# Altium schematic sheet DE-010824.SchDoc: eDoor_Motherboard
size A3; Author: eldar6776@hotmail.com; DrawnBy: Eldar Dedic; Organization: JUBERA d.o.o.; Address1: Braće Mulić 81; Address2: 71000 Sarajevo; Address3: Federacija BiH; Address4: Bosna i Hercegovina; DocumentNumber: DE-010824; Revision: 001; SheetNumber: 1; SheetTotal: 2
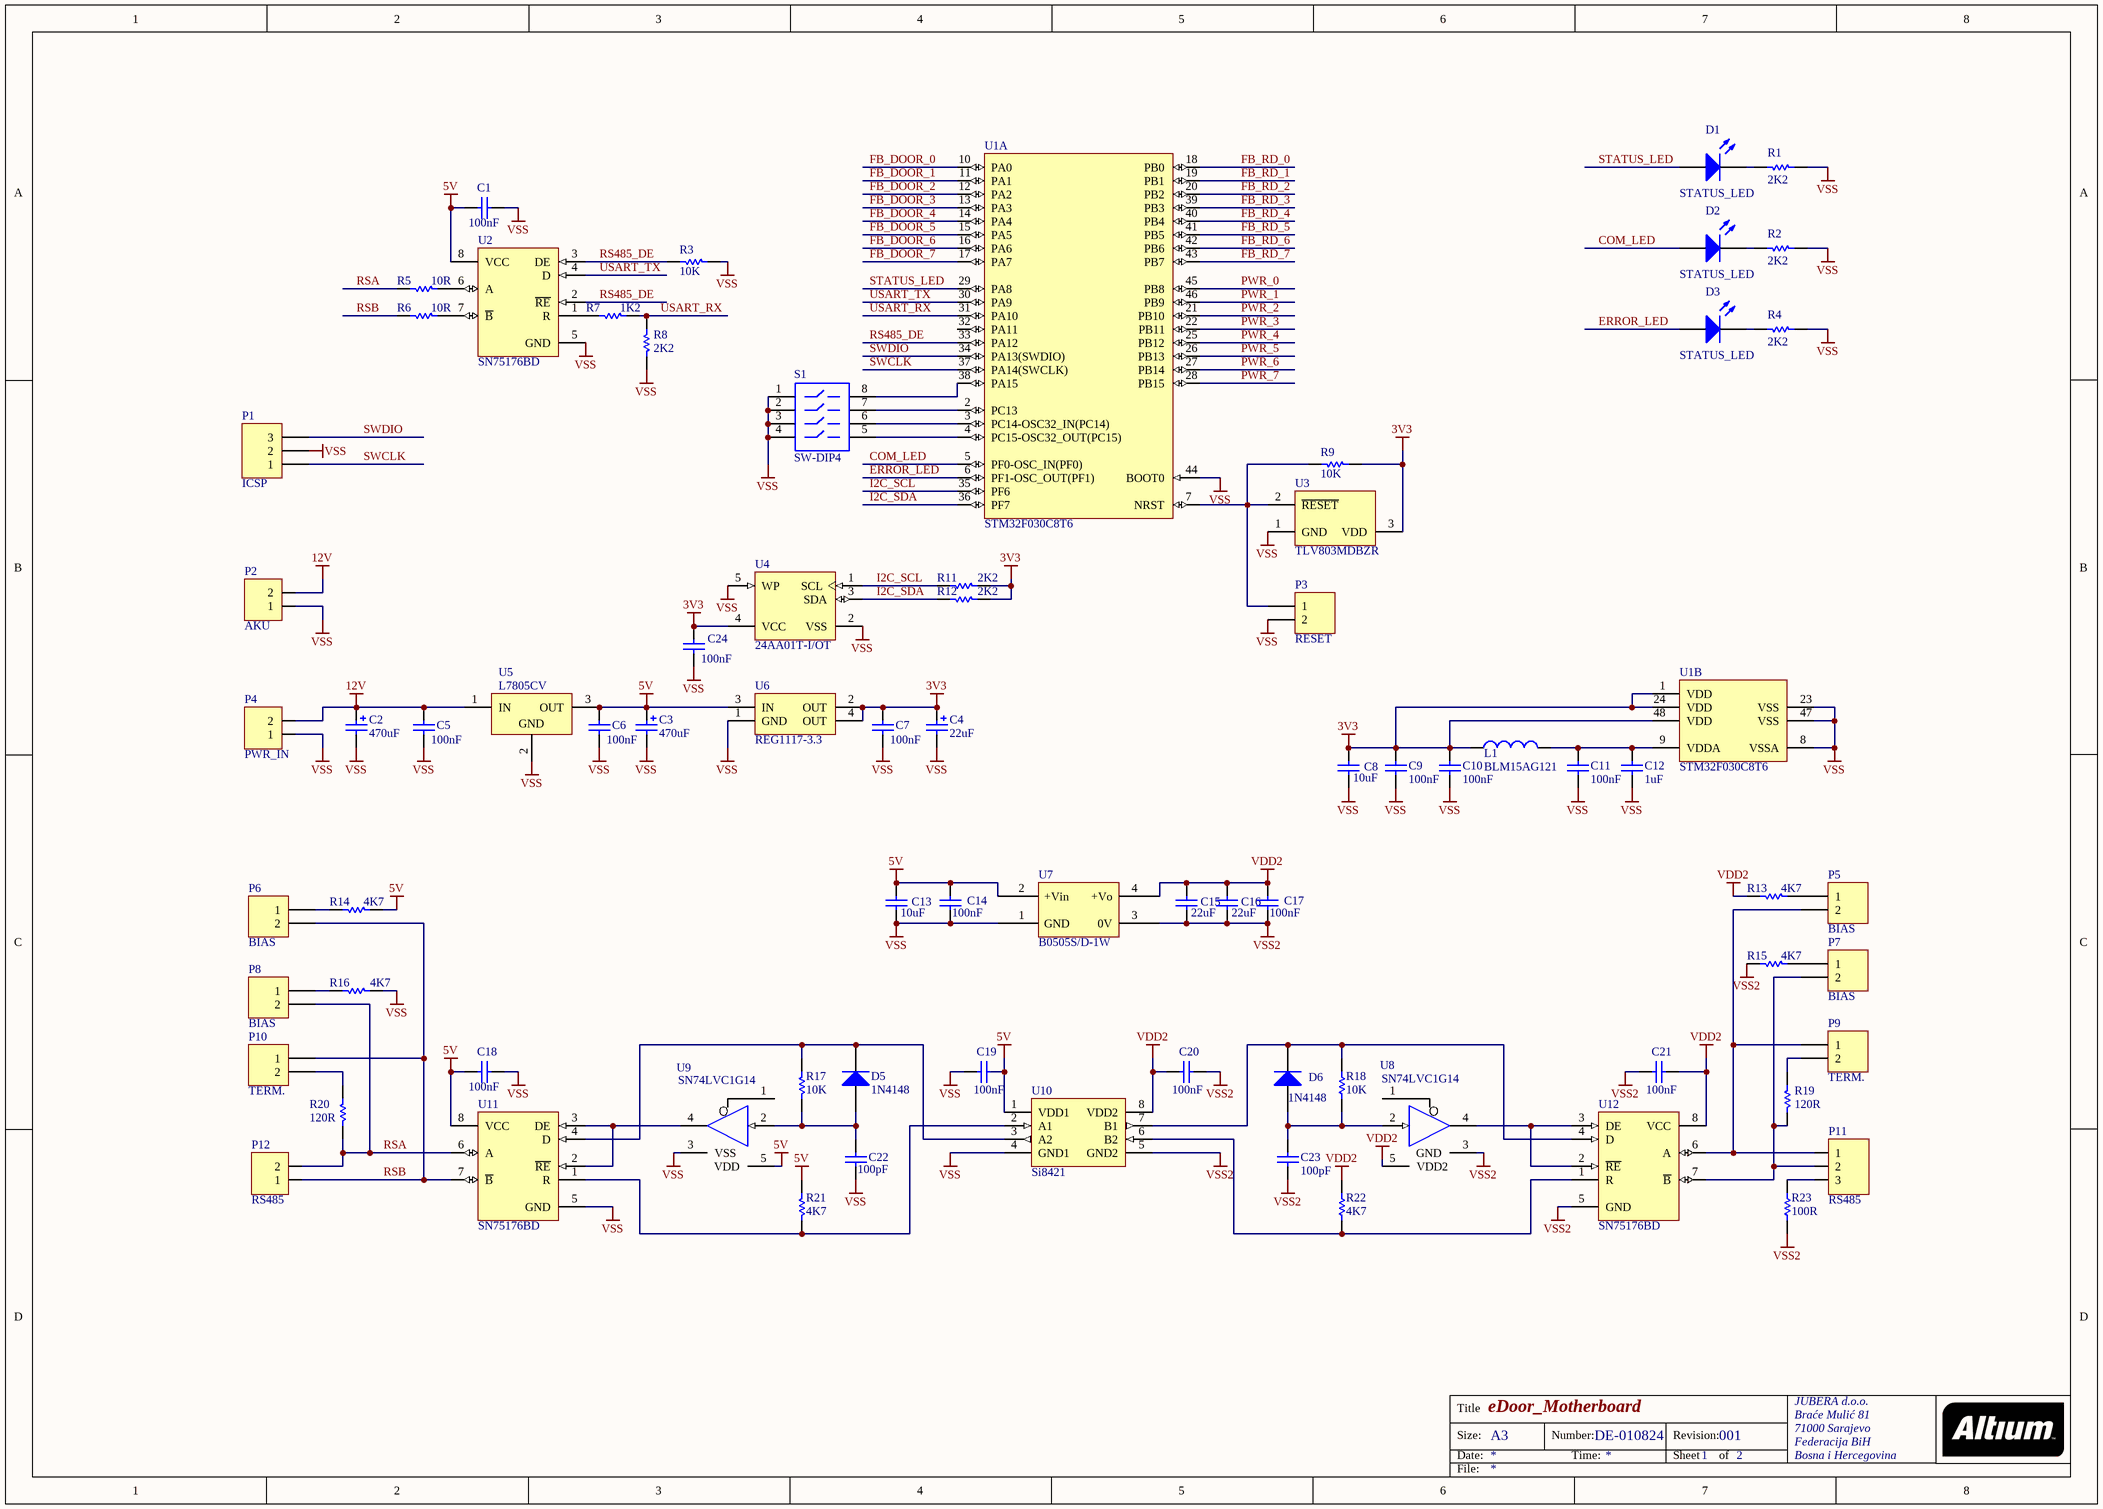
[diagram p0: DE-010824.SchDoc]

## Parts
C1  100nF  [0603]
C2  470uF  [CAPPR5-10X12.5]
C3  470uF  [CAPPR5-10X12.5]
C4  22uF  [CAPPR2-5X11]
C5  100nF  [0603]
C6  100nF  [0603]
C7  100nF  [0603]
C8  10uF  [0805]
C9  100nF  [0603]
C10  100nF  [0603]
C11  100nF  [0603]
C12  1uF  [0603]
C13  10uF  [0805]
C14  100nF  [0603]
C15  22uF  [0805]
C16  22uF  [0805]
C17  100nF  [0603]
C18  100nF  [0603]
C19  100nF  [0603]
C20  100nF  [0603]
C21  100nF  [0603]
C22  100pF  [0603]
C23  100pF  [0603]
C24  100nF  [0603]
D1  STATUS_LED  [1.6X0.8X0.8]
D2  STATUS_LED  [1.6X0.8X0.8]
D3  STATUS_LED  [1.6X0.8X0.8]
D5  1N4148  [SOD323]
D6  1N4148  [SOD323]
L1  BLM15AG121  [0603]
P1  ICSP  [HDR1X3]
P2  AKU  [TERMINAL BLOK 2]
P3  RESET  [HDR1X2]
P4  PWR_IN  [TERMINAL BLOK 2]
P5  BIAS  [HDR1X2]
P6  BIAS  [HDR1X2]
P7  BIAS  [HDR1X2]
P8  BIAS  [HDR1X2]
P9  TERM.  [HDR1X2]
P10  TERM.  [HDR1X2]
P11  RS485  [TERMINAL BLOK 3]
P12  RS485  [TERMINAL BLOK 2]
R1  2K2  [ERA-0603]
R2  2K2  [ERA-0603]
R3  10K  [ERA-0603]
R4  2K2  [ERA-0603]
R5  10R  [ERA-0603]
R6  10R  [ERA-0603]
R7  1K2  [ERA-0603]
R8  2K2  [ERA-0603]
R9  10K  [ERA-0603]
R11  2K2  [ERA-0603]
R12  2K2  [ERA-0603]
R13  4K7  [ERA-0603]
R14  4K7  [ERA-0603]
R15  4K7  [ERA-0603]
R16  4K7  [ERA-0603]
R17  10K  [ERA-0603]
R18  10K  [ERA-0603]
R19  120R  [ERA-0603]
R20  120R  [ERA-0603]
R21  4K7  [ERA-0603]
R22  4K7  [ERA-0603]
R23  100R  [ERA-0805]
S1  SW-DIP4  [DIP-8]
U1  STM32F030C8T6  [STM-LQFP48_N]  (parts A,B of 2)
U2  SN75176BD  [D008_N]
U3  TLV803MDBZR  [DBZ3_N]
U4  24AA01T-I/OT  [SOT-23-OT5_N]
U5  L7805CV  [TO220]
U6  REG1117-3.3  [ZZ311]
U7  B0505S/D-1W  [B0505S-1W]
U8  SN74LVC1G14  [419A-01_N]
U9  SN74LVC1G14  [419A-01_N]
U10  Si8421  [SOP8]
U11  SN75176BD  [D008_N]
U12  SN75176BD  [D008_N]

## Nets
3V3: C4.1 C7.2 C8.2 C9.1 C10.1 C24.2 L1.1 R9.2 R11.2 R12.2 U1.1(VDD) U1.24(VDD) U1.48(VDD) U3.3(VDD) U4.4(VCC) U6.2(OUT) U6.4(OUT)
5V: C1.1 C3.1 C6.2 C13.2 C14.2 C15.2 C16.2 C17.2 C18.1 C19.2 C20.2 C21.1 R13.2 R14.2 R21.2 R22.2 U2.8(VCC) U5.3(OUT) U6.3(IN) U7.2(+Vin) U7.4(+Vo) U8.5(VDD2) U9.5(VDD) U10.1(VDD1) U10.8(VDD2) U11.8(VCC) U12.8(VCC)  [also labelled VDD, VDD2]
12V: C2.1 C5.2 P2.2 P4.2 U5.1(IN)
GND: C1.2 C2.2 C3.2 C4.2 C5.1 C6.1 C7.1 C8.1 C9.2 C10.2 C11.2 C12.2 C13.1 C14.1 C15.1 C16.1 C17.1 C18.2 C19.1 C20.1 C21.2 C22.1 C23.1 C24.1 P1.2 P2.1 P3.2 P4.1 R1.1 R2.1 R3.1 R4.1 R8.2 R15.2 R16.2 R23.1 S1.1 S1.2 S1.3 S1.4 U1.8(VSSA) U1.23(VSS) U1.44(BOOT0) U1.47(VSS) U2.5(GND) U3.1(GND) U4.2(VSS) U4.5(WP) U5.2(GND) U6.1(GND) U7.1(GND) U7.3(0V) U8.3(GND) U9.3(VSS) U10.4(GND1) U10.5(GND2) U11.5(GND) U12.5(GND)  [also labelled VSS, VSS2]
COM_LED: D2.1(A) U1.5(PF0-OSC_IN(PF0))
ERROR_LED: D3.1(A) U1.6(PF1-OSC_OUT(PF1))
FB_DOOR_0: U1.10(PA0)
FB_DOOR_1: U1.11(PA1)
FB_DOOR_2: U1.12(PA2)
FB_DOOR_3: U1.13(PA3)
FB_DOOR_4: U1.14(PA4)
FB_DOOR_5: U1.15(PA5)
FB_DOOR_6: U1.16(PA6)
FB_DOOR_7: U1.17(PA7)
FB_RD_0: U1.18(PB0)
FB_RD_1: U1.19(PB1)
FB_RD_2: U1.20(PB2)
FB_RD_3: U1.39(PB3)
FB_RD_4: U1.40(PB4)
FB_RD_5: U1.41(PB5)
FB_RD_6: U1.42(PB6)
FB_RD_7: U1.43(PB7)
I2C_SCL: R11.1 U1.35(PF6) U4.1(SCL)
I2C_SDA: R12.1 U1.36(PF7) U4.3(SDA)
PWR_0: U1.45(PB8)
PWR_1: U1.46(PB9)
PWR_2: U1.21(PB10)
PWR_3: U1.22(PB11)
PWR_4: U1.25(PB12)
PWR_5: U1.26(PB13)
PWR_6: U1.27(PB14)
PWR_7: U1.28(PB15)
RS485_DE: R3.2 U1.33(PA12) U2.2(~{RE}) U2.3(DE)
RSA: P8.2 P12.2 R5.1 R20.1 U11.6(A)
RSB: P6.2 P10.1 P12.1 R6.1 U11.7(~{B})
STATUS_LED: D1.1(A) U1.29(PA8)
SWCLK: P1.1 U1.37(PA14(SWCLK))
SWDIO: P1.3 U1.34(PA13(SWDIO))
USART_RX: R7.1 R8.1 U1.31(PA10)
USART_TX: U1.30(PA9) U2.4(D)
NetC11_1: C11.1 C12.1 L1.2 U1.9(VDDA)
NetC22_2: C22.2 D5.2(A) R17.1 U9.2(A)
NetC23_2: C23.2 D6.2(A) R18.1 U8.2(A)
NetD1_2: D1.2(K) R1.2
NetD2_2: D2.2(K) R2.2
NetD3_2: D3.2(K) R4.2
NetD5_1: D5.1(K) R17.2 U10.3(A2) U11.4(D)
NetD6_1: D6.1(K) R18.2 U10.7(B1) U12.4(D)
NetP3_1: P3.1 R9.1 U1.7(NRST) U3.2(~{RESET})
NetP5_1: P5.1 R13.1
NetP5_2: P5.2 P9.1 P11.1 U12.6(A)
NetP6_1: P6.1 R14.1
NetP7_1: P7.1 R15.1
NetP7_2: P7.2 P11.2 R19.1 U12.7(~{B})
NetP8_1: P8.1 R16.1
NetP9_2: P9.2 R19.2
NetP10_2: P10.2 R20.2
NetP11_3: P11.3 R23.2
NetR5_2: R5.2 U2.6(A)
NetR6_2: R6.2 U2.7(~{B})
NetR7_2: R7.2 U2.1(R)
NetR21_1: R21.1 U10.2(A1) U11.1(R)
NetR22_1: R22.1 U10.6(B2) U12.1(R)
NetS1_5: S1.5 U1.4(PC15-OSC32_OUT(PC15))
NetS1_6: S1.6 U1.3(PC14-OSC32_IN(PC14))
NetS1_7: S1.7 U1.2(PC13)
NetS1_8: S1.8 U1.38(PA15)
NetU8_4: U8.4(Y) U12.2(~{RE}) U12.3(DE)
NetU9_4: U9.4(Y) U11.2(~{RE}) U11.3(DE)

Not connected (* = marked no-connect by the designer): U1 32(PA11); U8 1(NC); U9 1(NC)

## Notes on the sheet
- Title
- Size:
- Date:
- A3
- Number:
- Time:
- Revision:
- Sheet
- of
- File:

## Library data of the parts
C1 C5-C7 C9-C11 C14 C17-C24 = C0603: Ceramic Chip Capacitor - Standard; Note: Footprint corresponds to dimensions for bulk cassette packaging. This case size has tightened tolerances.; Published: 17-Jul-2002; LatestRevisionDate: 19-Mar-2004; LatestRevisionNote: Silkscreen size reduced.; DatasheetDocument: Mar-2001; PackageDocument: Mar-2001; PackageReference: 0603; Publisher: Altium Limited; Code_JEITA: 0603; Code_IPC: 1608 [0603]; ComponentLink1Description: Manufacturer Link; ComponentLink1URL: http://www.kemet.com/; ComponentLink2Description: Datasheet; ComponentLink2URL: http://www.kemet.com/kemet/web/homepage/kechome.nsf/vapubfilesname/F3102TA.pdf/$file/F3102TA.pdf
  C1 C5-C7 C9-C11 C14 C17-C21 C24: Value: 100nF
  C22 C23: Value: 100pF
C2 C3 = EKA00DC347E00: Aluminum Electrolytic Capacitor, Radial Style with Long Leads: 470uF, 25V; Note: Refer to Manufacturer's Data Sheets for other lead formations; DrillSize: Nominal, Rounded To The Nearest 0.1mm; Published: 19-Mar-2004; DatasheetDocument: 20-Feb-2001; PackageReference: CAPPR5-10X12.5; Publisher: Altium Limited; ComponentLink1Description: Manufacturer Link; ComponentLink1URL: http://www.vishay.com/; ComponentLink2Description: Datasheet; ComponentLink2URL: http://www.vishay.com/docs/25014/eka.pdf; Value: 470uF
C4 = EKA00AA247F00: Aluminum Electrolytic Capacitor, Radial Style with Long Leads: 47uF, 35V; Note: Refer to Manufacturer's Data Sheets for other lead formations; DrillSize: Nominal, Rounded To The Nearest 0.1mm; Published: 19-Mar-2004; DatasheetDocument: 20-Feb-2001; PackageReference: CAPPR2-5X11; Publisher: Altium Limited; ComponentLink1Description: Manufacturer Link; ComponentLink1URL: http://www.vishay.com/; ComponentLink2Description: Datasheet; ComponentLink2URL: http://www.vishay.com/docs/25014/eka.pdf; Value: 47uF
C8 C13 = C0805: Ceramic Chip Capacitor - Standard; Note: Footprint corresponds to dimensions for bulk cassette packaging. This case size has tightened tolerances.; Published: 17-Jul-2002; LatestRevisionDate: 19-Mar-2004; LatestRevisionNote: Silkscreen size reduced.; DatasheetDocument: Mar-2001; PackageDocument: Mar-2001; PackageReference: 0805; Publisher: Altium Limited; Code_JEITA: 0805; Code_IPC: 2012[0805]; ComponentLink1Description: Manufacturer Link; ComponentLink1URL: http://www.kemet.com/; ComponentLink2Description: Datasheet; ComponentLink2URL: http://www.kemet.com/kemet/web/homepage/kechome.nsf/vapubfilesname/F3102TA.pdf/$file/F3102TA.pdf; Value: 10uF
C12 = C0603: Ceramic Chip Capacitor - Standard; Note: Footprint corresponds to dimensions for bulk cassette packaging. This case size has tightened tolerances.; Value: 100nF; Published: 17-Jul-2002; LatestRevisionDate: 19-Mar-2004; LatestRevisionNote: Silkscreen size reduced.; DatasheetDocument: Mar-2001; PackageDocument: Mar-2001; PackageReference: 0603; Publisher: Altium Limited; Code_JEITA: 0603; Code_IPC: 1608 [0603]; ComponentLink1Description: Manufacturer Link; ComponentLink1URL: http://www.kemet.com/; ComponentLink2Description: Datasheet; ComponentLink2URL: http://www.kemet.com/kemet/web/homepage/kechome.nsf/vapubfilesname/F3102TA.pdf/$file/F3102TA.pdf
C15 C16 = C0805: Ceramic Chip Capacitor - Standard; Note: Footprint corresponds to dimensions for bulk cassette packaging. This case size has tightened tolerances.; Value: 10uF; Published: 17-Jul-2002; LatestRevisionDate: 19-Mar-2004; LatestRevisionNote: Silkscreen size reduced.; DatasheetDocument: Mar-2001; PackageDocument: Mar-2001; PackageReference: 0805; Publisher: Altium Limited; Code_JEITA: 0805; Code_IPC: 2012[0805]; ComponentLink1Description: Manufacturer Link; ComponentLink1URL: http://www.kemet.com/; ComponentLink2Description: Datasheet; ComponentLink2URL: http://www.kemet.com/kemet/web/homepage/kechome.nsf/vapubfilesname/F3102TA.pdf/$file/F3102TA.pdf
D1-D3 = HSMB-C190: Blue Surface Mount Chip LED, Blue; LuminousIntensity: 1.6mcd (Minimum).; PCB_Layout: Complies with manufacturer's recommendation.; Published: 11-Dec-2002; DatasheetVersion: 26-Feb-2002; PackageVersion: Mar-2002; PackageReference: 1.6X0.8X0.8; Publisher: Altium Limited; PackageDescription: SM LED; 2 Flat Leads; LED_Colour: Blue; ComponentLink1Description: Manufacturer Link; ComponentLink1URL: http://www.avagotech.com/; ComponentLink2Description: Datasheet; ComponentLink2URL: http://cp.literature.agilent.com/litweb/pdf/5988-5211EN.pdf
D5 D6 = BAS321: General-purpose Diode; Published: 17-Sep-2003; LatestRevisionDate: 19-Mar-2004; LatestRevisionNote: Silkscreen size reduced.; DatasheetVersion: 9-Feb-1999; PackageVersion: May-1999; PackageReference: SOD323; Publisher: Altium Limited; PackageDescription: SOD-323/SC-76; 2 Leads; Body 1.7 x 1.3 mm, (LxW); ComponentLink1Description: Manufacturer Link; ComponentLink1URL: http://www.semiconductors.philips.com/; ComponentLink2Description: Datasheet; ComponentLink2URL: http://www.semiconductors.philips.com/acrobat/datasheets/BAS321_2.pdf
L1 = Chip inductor: SMD chip inductor; Code_IEC: 1005; Published: 8-Jun-2000; LatestRevisionDate: 29-May-2009; LatestRevisionNote: IPC-7351 Footprint Added.; PackageReference: 0402-A; Publisher: Altium Limited; PackageDescription: Chip Inductor; Code_JEITA: 0402
P1 = Header 3: Header, 3-Pin; LatestRevisionDate: 17-Jul-2002; LatestRevisionNote: Re-released for DXP Platform.; Publisher: Altium Limited
P2 P4 P12 = TERMINAL BLOK 2: Terminal blok konektor 3,5 mm
P3 P5-P10 = Header 2: Header, 2-Pin; LatestRevisionDate: 17-Jul-2002; LatestRevisionNote: Re-released for DXP Platform.; Publisher: Altium Limited
P11 = TERMINAL BLOK 3: 3 pinski terminal blok konektor
R1-R9 R11-R22 = ERAV: Metal Film Thermosensitive Chip Resistor, 0.56 Ohm to 10k Ohm Range, 5% Tolerance, 0603 Size, 0.063 W; Note: If flow soldering, adjust pad width of PCB Footprint to 0.7 - 0.8 times the width of the resistor.; Published: 17-Dec-2003; LatestRevisionDate: 19-Mar-2004; LatestRevisionNote: Silkscreen size reduced.; PackageDocument: Mar-2003; PackageReference: ERA-0603; Publisher: Altium Limited; Code_IPC: 1608 [0603]; ComponentLink1Description: Manufacturer Link; ComponentLink1URL: http://www.panasonic.com/industrial/components/resistive_products.htm; ComponentLink2Description: Datasheet; ComponentLink2URL: http://www.panasonic.com/industrial/components/pdf/AOF0000CE1.pdf
R23 = ERA6Y: Rectangular Thick Film Chip Resistor, 10 Ohm to 1M Ohm Range, 0.1% and 0.5% Tolerance, 0805 Size, 0.1 W; Note: If flow soldering, adjust pad width of PCB Footprint to 0.7 - 0.8 times the width of the resistor.; Published: 17-Dec-2003; LatestRevisionDate: 19-Mar-2004; LatestRevisionNote: Silkscreen size reduced.; PackageDocument: Mar-2003; PackageReference: ERA-0805; Publisher: Altium Limited; Code_IPC: 2012 [0805]; ComponentLink1Description: Manufacturer Link; ComponentLink1URL: http://www.panasonic.com/industrial/components/resistive_products.htm; ComponentLink2Description: Datasheet; ComponentLink2URL: http://www.panasonic.com/industrial/components/pdf/AOA0000CE8.pdf
S1 = SW-DIP4: DIP Switch; Published: 24-Mar-1999; LatestRevisionDate: 17-Jul-2002; LatestRevisionNote: Re-released for DXP Platform.; PackageReference: DIP-8; Publisher: Altium Limited
U1 = STM32F030C8T6: ARM Cortex-M0 32-bit MCU, 64 KB Flash, 8 KB Internal RAM, 39 I/Os, 48-pin LQFP, -40 to 85 degC, Tray; FLASH Size (Prog) (kB): 64; I/Os (High Current): 39; Internal RAM Size (kB): 8; Operating Frequency(F) (Processor speed) (MHz): 48; Supply Voltage(Vcc) min (V): 2.4; DatasheetVersion: Rev. 1; PackageVersion: Rev. 6, 06/2013; PackageReference: LQFP48; PackageDescription: 48-Pin Low Profile Quad Flat Package, 7 x 7 mm Body, 0.5 mm Pitch; Supplier 1: Digi-Key; Supplier Part Number 1: 497-14043-ND; Supplier 2: Newark; Supplier Part Number 2: 06X3647; Supplier 3: Mouser; Supplier Part Number 3: 511-STM32F030C8T6; Core: ARM Cortex-M0; Packing: Tray; Mounting Technology: Surface Mount; PartNumber: STM32F030C8T6; ComponentLink1Description: Manufacturer URL; ComponentLink1URL: http://www.st.com/web/en/home.html; ComponentLink2Description: Datasheet; ComponentLink2URL: http://www.st.com/st-web-ui/static/active/en/resource/technical/document/datasheet/DM00088500.pdf; ComponentLink3Description: Package Specification; ComponentLink3URL: http://www.st.com/st-web-ui/static/active/en/resource/technical/document/datasheet/DM00058181.pdf
U2 U11 U12 = SN75176BD: Differential Bus Transceiver; Note: Receiver Hysteresis of 50mV Typical; Published: 15-May-2002; LatestRevisionDate: 13-Apr-2006; LatestRevisionNote: IPC-7351 Footprint Added.; DatasheetVersion: Sep-1989; PackageVersion: Jan-1998; PackageReference: D008; Publisher: Altium Limited; PackageDescription: 8-Pin Small Outline Integrated Circuit 1.27 mm Pitch; Code_IPC: SOIC127P600-8; ComponentLink1Description: Manufacturer Link; ComponentLink1URL: http://www.ti.com/; ComponentLink2Description: Datasheet; ComponentLink2URL: http://www-s.ti.com/sc/ds/sn75176b.pdf
U3 = TLV803MDBZR: Voltage Supervisor with Active-Low, Open Drain Reset, 1 Supply Monitored, -40 to 125 degC, 3-pin SOT-23 (DBZ), Green (RoHS & no Sb/Br); Manufacturer: Texas Instruments; # of supplies monitored: 1; Iq(Typ)(uA): 9; Output Driver Type / Reset Output: Active-low, Open-drain; Rating: Catalog; Reset Threshold Accuracy(%): 2; SubFamily: Supervisor and Reset IC; Threshold Voltage 1 (typ)(Typ)(V): 4.38; Time Delay(ms): 200; VCC(Max)(V): 6; VCC(Min)(V): 1.1; DatasheetVersion: SBVS157B; PackageVersion: revB, Apr-2005; PackageReference: DBZ3; PackageDescription: 3-Pin Plastic Small-Outline Package, 0.95 mm Pitch, 2.4 mm Lead Span; Supplier 1: Digi-Key; Supplier Part Number 1: 296-29194-2-ND; Supplier 2: Digi-Key; Supplier Part Number 2: 296-29194-1-ND; Supplier 3: Digi-Key; Supplier Part Number 3: 296-29194-6-ND; Supplier 4: Newark; Supplier Part Number 4: 58T0286; Supplier 5: Mouser; Supplier Part Number 5: 595-TLV803MDBZR; Mounting Technology: Surface Mount; Code_JEDEC: TO-236-AB; PartNumber: TLV803MDBZR; ComponentLink1Description: Datasheet; ComponentLink1URL: http://www.ti.com/general/docs/lit/getliterature.tsp?genericPartNumber=TLV803M&fileType=pdf
U4 = 24AA01T-I/OT: 1Kbit, 400kHz, 1.8V, I2C Serial EEPROM, 5-Pin SOT-23, Industrial Temperature, Tape and Reel; Published: 29-Jan-2009; DatasheetVersion: revJ, Jan-2009; PackageVersion: revBB, Aug-2009; PackageReference: SOT-23-OT5; Publisher: Altium Limited; PackageDescription: 5-Lead Plastic Small Outline Transistor (OT) [SOT-23]; Supplier 1: Digi-Key; Supplier Part Number 1: 24AA01T-I/OTTR-ND; Supplier 2: Digi-Key; Supplier Part Number 2: 24AA01T-I/OTCT-ND; Supplier 3: Digi-Key; Supplier Part Number 3: 24AA01T-I/OTDKR-ND; Supplier 4: Farnell; Supplier Part Number 4: 1331269; Code_IPC: SOT23-5; ComponentLink1Description: Datasheet; ComponentLink1URL: http://ww1.microchip.com/downloads/en/DeviceDoc/21711J.pdf; ComponentLink2Description: Packaging Specification; ComponentLink2URL: http://www.microchip.com/stellent/groups/techpub_sg/documents/packagingspec/en012702.pdf; ComponentLink3Description: Microchip.com Home; ComponentLink3URL: http://www.microchip.com/
U5 = L7805CV: Positive Voltage Regulator, 5V, 3-Pin TO-220; DatasheetVersion: Nov-2011; PackageVersion: ver3.0; PackageReference: TO220; PackageDescription: TO, Thru-Hole, Vertical, Heatsink Mounted; 3 In-Line Leads; Pitch 2.54 mm; PartNumber: L7805CV; ComponentLink1Description: Manufacturer URL; ComponentLink1URL: http://www.st.com; ComponentLink2Description: Datasheet; ComponentLink2URL: http://www.st.com/internet/com/TECHNICAL_RESOURCES/TECHNICAL_LITERATURE/DATASHEET/CD00000444.pdf; ComponentLink3Description: Package Specification; ComponentLink3URL: http://www.st.com/internet/com/TECHNICAL_RESOURCES/TECHNICAL_LITERATURE/PACKAGE_INFORMATION/CD00004649.pdf
U6 = REG1117-3.3: 800mA and 1A Low Dropout Positive Regulator 2.85V, 3.3V, 5V, and Adjustable; Published: 8-Jun-2000; LatestRevisionDate: 17-Jul-2002; LatestRevisionNote: Re-released for DXP Platform.; DatasheetVersion: Sep-1997; PackageVersion: revC; PackageReference: ZZ311; Publisher: Altium Limited; PackageDescription: SOT-223/SC-73; 4 Leads; Body 6.7 x 7.3 mm, inc. leads (LxW max); ComponentLink1Description: Manufacturer Link; ComponentLink1URL: http://www.ti.com/; ComponentLink2Description: Datasheet; ComponentLink2URL: http://www-s.ti.com/sc/ds/REG1117.pdf
U7 = B0505S/D: 1W isolated dc dc converter
U8 U9 = MC74VHC1G125DFT1: Non-Inverting 3-State Buffer; Published: 15-Apr-2002; LatestRevisionDate: 12-Dec-2006; LatestRevisionNote: IPC-7351 Footprint Added.; DatasheetVersion: Feb-2000; PackageVersion: Oct-1999; PackageReference: 419A-01; Publisher: Altium Limited; PackageDescription: 5-Pin SOT-353 Package 0.65 mm Pitch, 2.1 mm Lead Span; ComponentLink1Description: Manufacturer Link; ComponentLink1URL: http://www.onsemi.com/; ComponentLink2Description: Datasheet; ComponentLink2URL: http://www.onsemi.com/pub/Collateral/MC74VHC1G125-D.PDF
U10 = Si8421: Silicon Labs low power dual chanel digital isolator